# EAGLE design Reader_0001 (EAGLE 6.5.0)
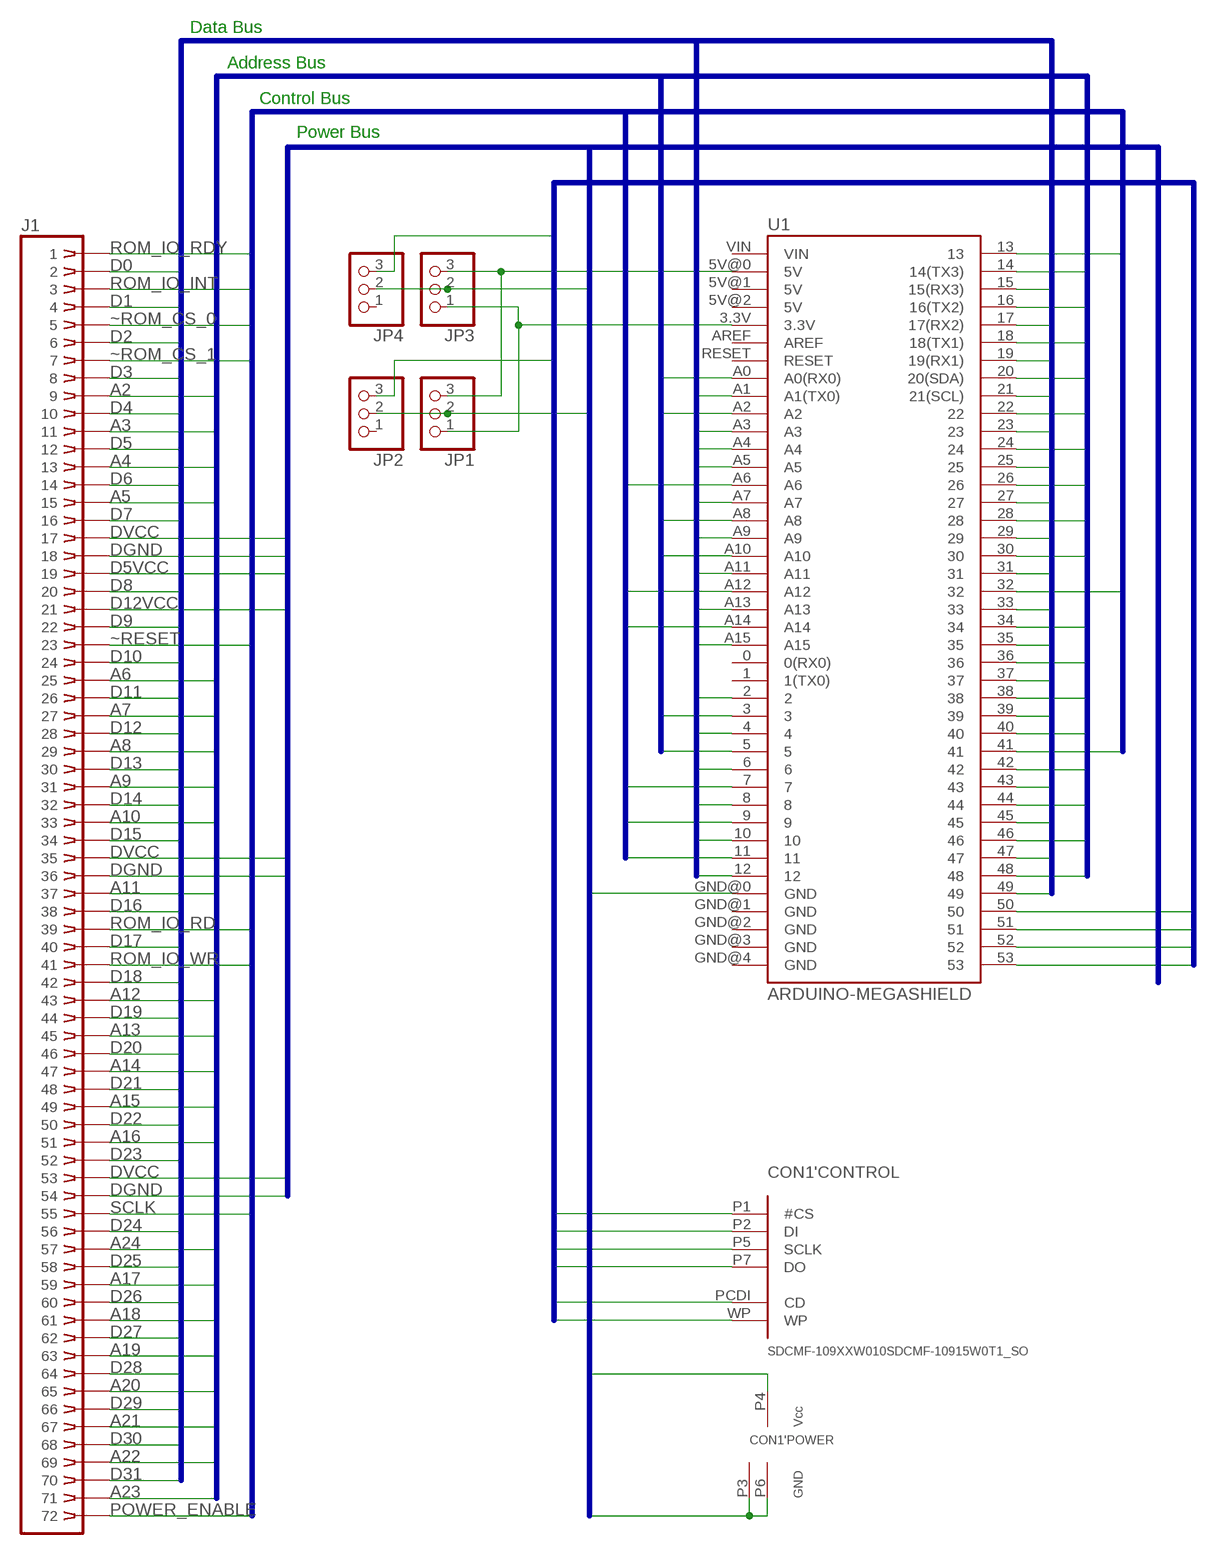
[diagram p0: schematic, sheet 1]

## Parts
CON1  SDCMF-109XXW010SDCMF-10915W0T1_SO  [SDCMF-10915W0T1]
J1  DIMM-M3  [177827-1]
JP1  PINHD-1X3  [1X03]
JP2  PINHD-1X3  [1X03]
JP3  PINHD-1X3  [1X03]
JP4  PINHD-1X3  [1X03]
U1  ARDUINO-MEGASHIELD  [ARDUINO_MEGA_SHIELD]

## Nets
A2: J1.9 U1.5
A3: J1.11 U1.3
A4: J1.13 U1.A0(A0(RX0))
A5: J1.15 U1.A2
A6: J1.25 U1.14(14(TX3))
A7: J1.27 U1.16(16(TX2))
A8: J1.29 U1.18(18(TX1))
A9: J1.31 U1.20(20(SDA))
A10: J1.33 U1.A8
A11: J1.37 U1.A10
A12: J1.43 U1.22
A13: J1.45 U1.24
A14: J1.47 U1.26
A15: J1.49 U1.28
A16: J1.51 U1.30
A17: J1.59 U1.36
A18: J1.61 U1.38
A19: J1.63 U1.40
A20: J1.65 U1.48
A21: J1.67 U1.46
A22: J1.69 U1.44
A23: J1.71 U1.42
A24: J1.57 U1.34
D0: J1.2 U1.12
D1: J1.4 U1.10
D2: J1.6 U1.8
D3: J1.8 U1.6
D4: J1.10 U1.4
D5: J1.12 U1.2
D5VCC: J1.19 JP1.2 JP2.2
D6: J1.14 U1.A1(A1(TX0))
D7: J1.16 U1.A3
D8: J1.20 U1.A4
D9: J1.22 U1.A5
D10: J1.24 U1.A7
D11: J1.26 U1.15(15(RX3))
D12: J1.28 U1.17(17(RX2))
D12VCC: J1.21
D13: J1.30 U1.19(19(RX1))
D14: J1.32 U1.21(21(SCL))
D15: J1.34 U1.A9
D16: J1.38 U1.A11
D17: J1.40 U1.A13
D18: J1.42 U1.A15
D19: J1.44 U1.23
D20: J1.46 U1.25
D21: J1.48 U1.27
D22: J1.50 U1.29
D23: J1.52 U1.31
D24: J1.56 U1.33
D25: J1.58 U1.35
D26: J1.60 U1.37
D27: J1.62 U1.39
D28: J1.64 U1.49
D29: J1.66 U1.47
D30: J1.68 U1.45
D31: J1.70 U1.43
DGND: CON1.P3('POWER:GND) CON1.P6('POWER:GND) J1.18 J1.36 J1.54 U1.GND@0(GND)
DVCC: CON1.P4('POWER:VCC) J1.17 J1.35 J1.53 JP3.2 JP4.2
N$1: JP1.3 JP3.3 U1.5V@0(5V)
N$2: JP1.1 JP3.1 U1.3.3V
POWER_ENABLE: J1.72 U1.41
ROM_IO_INT: J1.3 U1.11
ROM_IO_RD: J1.39 U1.A12
ROM_IO_RDY: J1.1 U1.13
ROM_IO_WR: J1.41 U1.A14
SCLK: J1.55 U1.32
SD_CD: CON1.PCDI('CONTROL:CD)
SD_CLCK: CON1.P5('CONTROL:SCLK) U1.52
SD_CS: CON1.P1('CONTROL:#CS) U1.53
SD_DI: CON1.P2('CONTROL:DI) JP2.3 U1.51
SD_DO: CON1.P7('CONTROL:DO) JP4.3 U1.50
SD_WP: CON1.WP('CONTROL:WP)
~RESET: J1.23 U1.A6
~ROM_CS_0: J1.5 U1.9
~ROM_CS_1: J1.7 U1.7
Unconnected: JP2.1 JP4.1 U1.0(0(RX0)) U1.1(1(TX0)) U1.5V@1(5V) U1.5V@2(5V) U1.AREF U1.GND@1(GND) U1.GND@2(GND) U1.GND@3(GND) U1.GND@4(GND) U1.RESET U1.VIN

## Buses
D[0..31]
A[0..31]
ROM_IO_RDY,ROM_IO_INT,~ROM_CS_0,~ROM_CS_1,~RESET,ROM_IO_RD,ROM_IO_WR,POWER_ENABLE,SCLK
DVCC,DGND,D12VCC,D5VCC
SD_CS,SD_DI,SD_DO,SD_CLCK,SD_CD,SD_WP

## Notes on the sheet
- Data Bus
- Address Bus
- Control Bus
- Power Bus

## Library data of the parts
CON1 = card_adapters:SDCMF-109XXW010: KingFont SD-CARD SDCMF-109XXW010 SPI -MODE
J1 = con-amp:DIMM-M3: AMP connector
JP1-JP4 = pinhead:PINHD-1X3: PIN HEADER
U1 = SparkFun-Boards:ARDUINO-MEGA: Arduino Mega board footprint

## Board
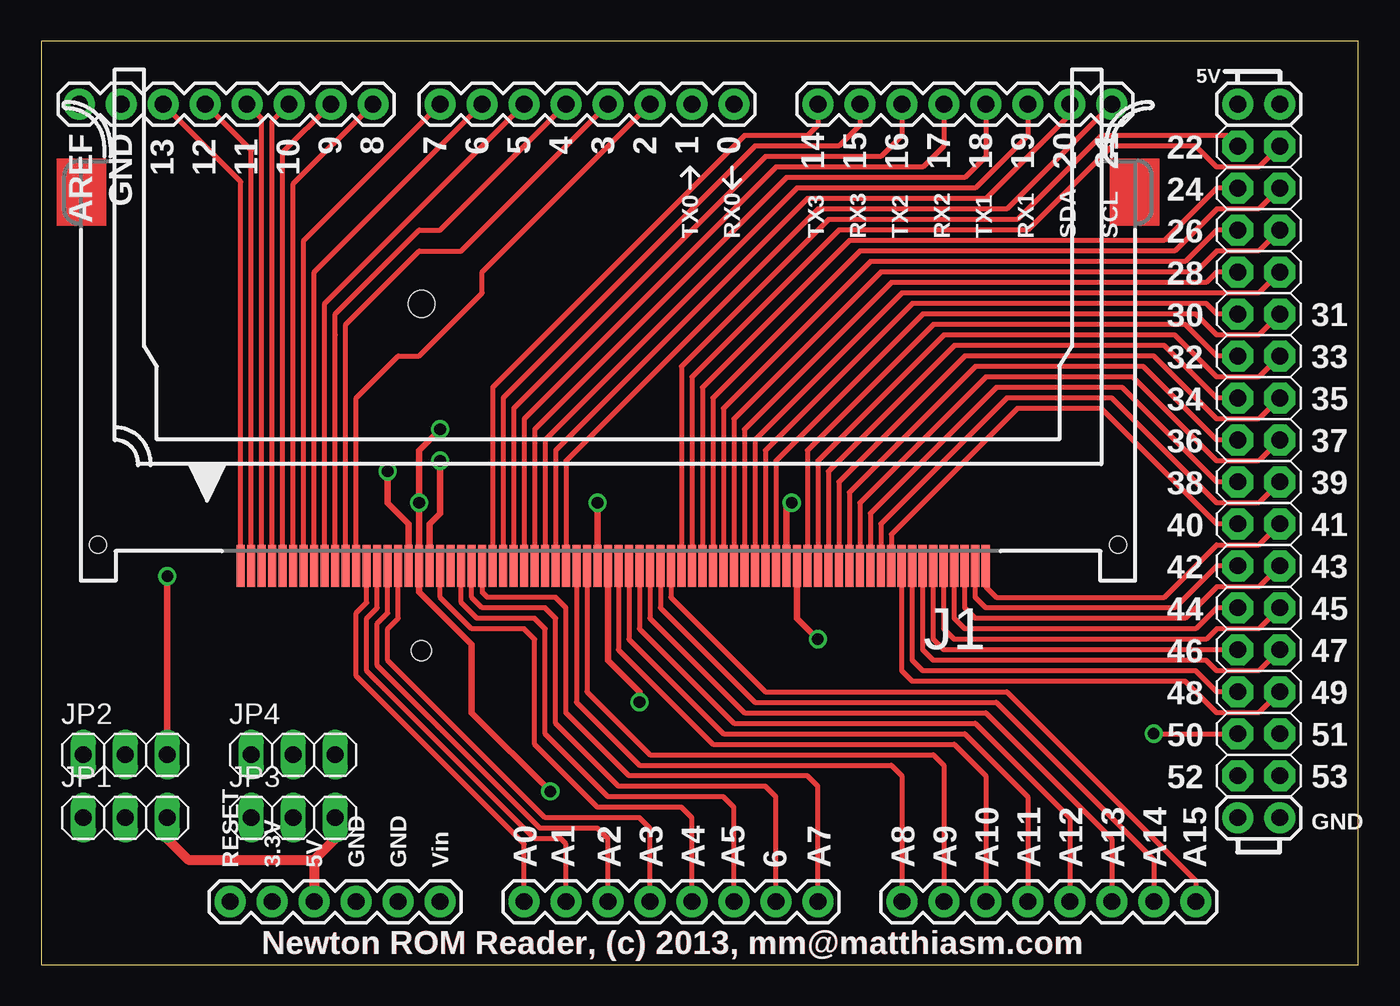
[diagram p1: board, top side]
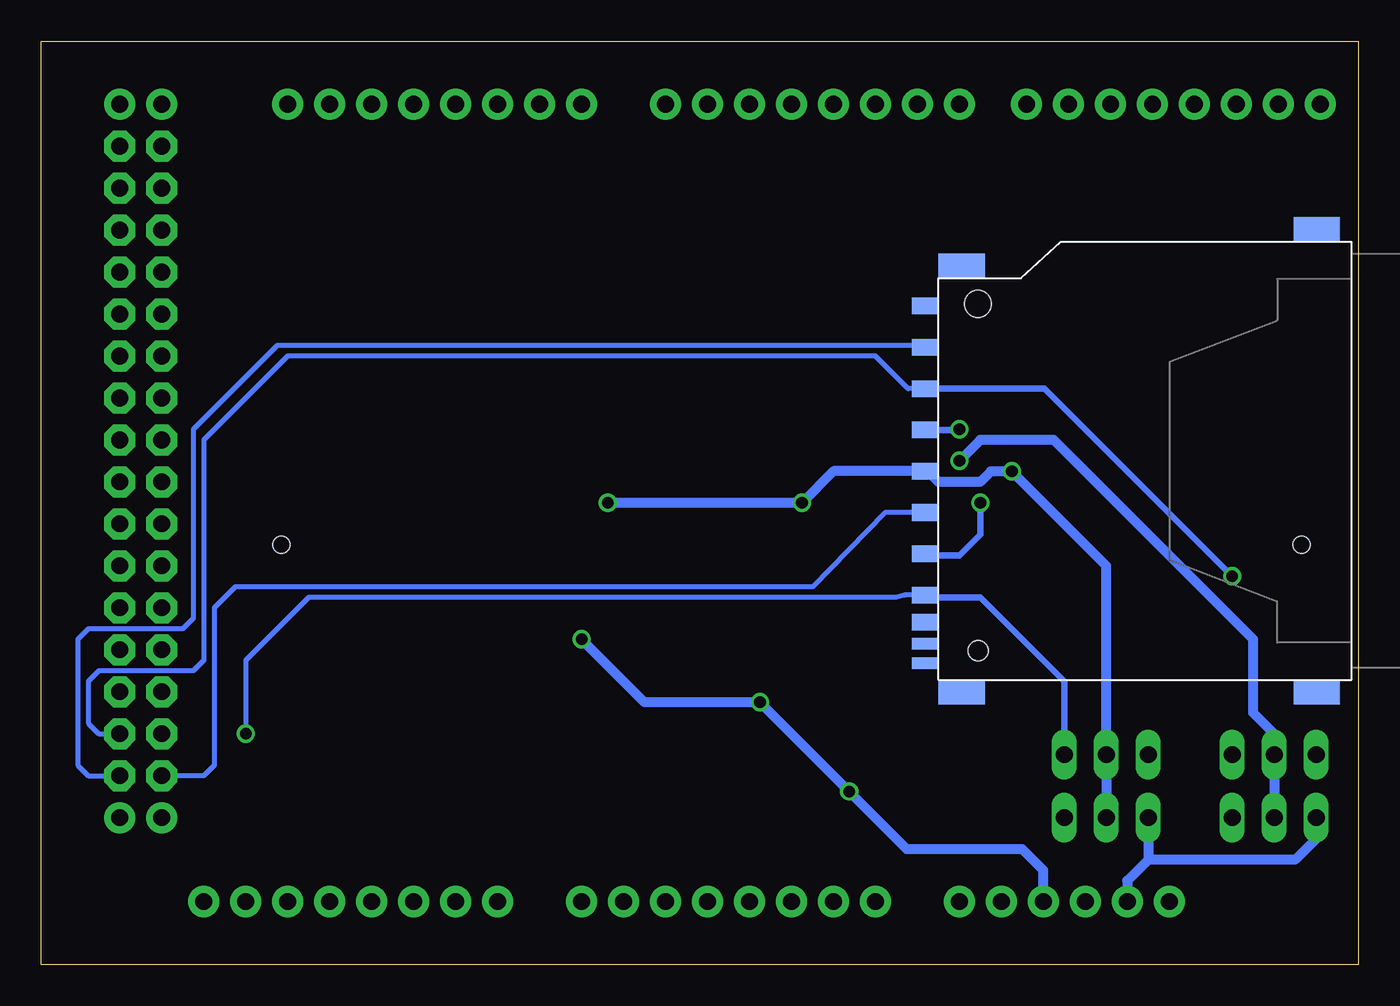
[diagram p2: board, bottom side, seen from below]

Size 79.68 x 55.87 mm. Coordinates in mm from the lower left corner, seen from the top.
Outline: 0,0 79.68,0 79.68,55.87 0,55.87 0,0
Copper layers (1*16): Top 0.035mm / dielectric 1.5mm / Bottom 0.035mm
Design rules "default": minimum track width 10mil, minimum drill 24mil, track to track 8mil, track to pad 8mil, pad to pad 8mil, via to via 8mil, smd to smd 8mil, copper to edge 40mil, drill to drill 8mil, minimum pad ring 10mil, minimum via ring 8mil, stop-mask expansion 4mil, vias tented up to drill 0mil, thermal gap 10mil

### Footprints (pad centres in the part's own frame; a part is rotated, then mirrored left to right if it is on the bottom)
SDCMF-10915W0T1 = smd 1.5 x 2.8: F1 -14,-1.4; F2 11.8,-1.4; F3 -14,-22.9; F4 14,-22.9 | smd 1 x 1.5: P1 6.875,0.85; P2 4.375,0.85; P3 1.875,0.85; P4 -0.625,0.85; P5 -3.125,0.85; P6 -5.625,0.85; P7 -8.125,0.85; P8 -9.75,0.85; P9 9.375,0.85 | smd 0.7 x 1.5: PCDI -11.05,0.85; WP -12.25,0.85 | hole 1.6: 9.5,-2.4 | hole 1.2: -11.5,-2.4
177827-1 = smd 0.508 x 2.54: 1 22.225,1.27; 2 21.59,1.27; 3 20.955,1.27; 4 20.32,1.27; 5 19.685,1.27; 6 19.05,1.27; 7 18.415,1.27; 8 17.78,1.27; 9 17.145,1.27; 10 16.51,1.27; 11 15.875,1.27; 12 15.24,1.27; 13 14.605,1.27; 14 13.97,1.27; 15 13.335,1.27; 16 12.7,1.27; 17 12.065,1.27; 18 11.43,1.27; 19 10.795,1.27; 20 10.16,1.27; 21 9.525,1.27; 22 8.89,1.27; 23 8.255,1.27; 24 7.62,1.27; 25 6.985,1.27; 26 6.35,1.27; 27 5.715,1.27; 28 5.08,1.27; 29 4.445,1.27; 30 3.81,1.27; 31 3.175,1.27; 32 2.54,1.27; 33 1.905,1.27; 34 1.27,1.27; 35 0.635,1.27; 36 0,1.27; 37 -0.635,1.27; 38 -1.27,1.27; 39 -1.905,1.27; 40 -2.54,1.27; 41 -3.175,1.27; 42 -3.81,1.27; 43 -4.445,1.27; 44 -5.08,1.27; 45 -5.715,1.27; 46 -6.35,1.27; 47 -6.985,1.27; 48 -7.62,1.27; 49 -8.255,1.27; 50 -8.89,1.27; 51 -9.525,1.27; 52 -10.16,1.27; 53 -10.795,1.27; 54 -11.43,1.27; 55 -12.065,1.27; 56 -12.7,1.27; 57 -13.335,1.27; 58 -13.97,1.27; 59 -14.605,1.27; 60 -15.24,1.27; 61 -15.875,1.27; 62 -16.51,1.27; 63 -17.145,1.27; 64 -17.78,1.27; 65 -18.415,1.27; 66 -19.05,1.27; 67 -19.685,1.27; 68 -20.32,1.27; 69 -20.955,1.27; 70 -21.59,1.27; 71 -22.225,1.27; 72 -22.86,1.27 | hole 1.016: -30.861,0; 30.861,0
1X03 = drill 1.016 long: 1 -2.54,0; 2 0,0; 3 2.54,0
ARDUINO_MEGA_SHIELD = drill 1.016 pad 1.88: 0 12.7,24.13; 1 10.16,24.13; 2 7.62,24.13; 3 5.08,24.13; 3.3V -15.24,-24.13; 4 2.54,24.13; 5 0,24.13; 5V@0 -12.7,-24.13; 5V@1 43.18,24.13; 5V@2 45.72,24.13; 6 -2.54,24.13; 7 -5.08,24.13; 8 -9.144,24.13; 9 -11.684,24.13; 10 -14.224,24.13; 11 -16.764,24.13; 12 -19.304,24.13; 13 -21.844,24.13; 14 17.78,24.13; 15 20.32,24.13; 16 22.86,24.13; 17 25.4,24.13; 18 27.94,24.13; 19 30.48,24.13; 20 33.02,24.13; 21 35.56,24.13; A0 0,-24.13; A1 2.54,-24.13; A2 5.08,-24.13; A3 7.62,-24.13; A4 10.16,-24.13; A5 12.7,-24.13; A6 15.24,-24.13; A7 17.78,-24.13; A8 22.86,-24.13; A9 25.4,-24.13; A10 27.94,-24.13; A11 30.48,-24.13; A12 33.02,-24.13; A13 35.56,-24.13; A14 38.1,-24.13; A15 40.64,-24.13; AREF -26.924,24.13; GND@0 -10.16,-24.13; GND@1 -7.62,-24.13; GND@2 43.18,-19.05; GND@3 45.72,-19.05; GND@4 -24.384,24.13; RESET -17.78,-24.13; VIN -5.08,-24.13 | drill 1.016 pad 1.88 octagon: 22 43.18,21.59; 23 45.72,21.59; 24 43.18,19.05; 25 45.72,19.05; 26 43.18,16.51; 27 45.72,16.51; 28 43.18,13.97; 29 45.72,13.97; 30 43.18,11.43; 31 45.72,11.43; 32 43.18,8.89; 33 45.72,8.89; 34 43.18,6.35; 35 45.72,6.35; 36 43.18,3.81; 37 45.72,3.81; 38 43.18,1.27; 39 45.72,1.27; 40 43.18,-1.27; 41 45.72,-1.27; 42 43.18,-3.81; 43 45.72,-3.81; 44 43.18,-6.35; 45 45.72,-6.35; 46 43.18,-8.89; 47 45.72,-8.89; 48 43.18,-11.43; 49 45.72,-11.43; 50 43.18,-13.97; 51 45.72,-13.97; 52 43.18,-16.51; 53 45.72,-16.51

### Placement (x,y rotation side)
CON1  25.4,30.48 90 bottom
J1  34.29,25.4 180 top
JP1  5.08,8.89 0 top
JP2  5.08,12.7 0 top
JP3  15.24,8.89 0 top
JP4  15.24,12.7 0 top
U1  29.21,27.94 0 top

### Tracks (layer width: path | path; a pad name or v marks a point on that pad's centre or on a via)
A2
  Top 0.305: J1.9 17.14,40.01 U1.5
A3
  Top 0.305: J1.11 18.41,38.73 22.86,43.18 25.4,43.18 U1.3
A4
  Top 0.305: U1.A0 29.21,7.3 19.05,17.46 19.05,21.27 19.68,21.91 J1.13
A5
  Top 0.305: U1.A2 34.29,7.62 33.66,8.26 30.16,8.26 20.32,18.1 20.32,20.64 20.95,21.27 J1.15
A6
  Top 0.305: U1.14 46.99,50.8 46.35,50.16 42.55,50.16 27.3,34.92 J1.25
A7
  Top 0.305: U1.16 52.07,50.16 50.8,48.9 43.81,48.9 28.57,33.66 J1.27
A8
  Top 0.305: U1.18 57.15,48.9 55.88,47.62 45.09,47.62 29.84,32.38 J1.29
A9
  Top 0.305: U1.20 62.23,51.44 57.15,46.35 46.35,46.35 31.11,31.11 J1.31
A10
  Top 0.305: J1.33 32.38,15.88 36.2,12.06 51.44,12.06 52.07,11.43 U1.A8
A11
  Top 0.305: J1.37 34.92,19.05 40.64,13.34 55.24,13.34 57.15,11.43 U1.A10
A12
  Top 0.305: U1.22 71.75,50.16 64.14,50.16 59.05,45.09 47.62,45.09 38.73,36.2 J1.43
A13
  Top 0.305: U1.24 71.12,46.99 67.94,43.81 48.9,43.81 40.01,34.92 J1.45
A14
  Top 0.305: U1.26 71.12,44.45 69.22,42.55 50.16,42.55 41.27,33.66 J1.47
A15
  Top 0.305: U1.28 71.12,41.91 70.48,41.27 51.44,41.27 42.55,32.38 J1.49
A16
  Top 0.305: U1.30 71.12,39.37 70.48,40.01 52.7,40.01 43.81,31.11 J1.51
A17
  Top 0.305: U1.36 71.12,31.75 66.67,36.2 56.52,36.2 48.9,28.57 J1.59
A18
  Top 0.305: U1.38 71.12,29.21 65.41,34.92 57.78,34.92 50.16,27.3 J1.61
A19
  Top 0.305: U1.40 71.12,26.67 64.14,33.66 59.05,33.66 51.44,26.04 J1.63
A20
  Top 0.305: U1.48 71.12,16.51 69.85,17.78 53.34,17.78 52.7,18.41 J1.65
A21
  Top 0.305: U1.46 54.61,19.05 53.98,19.68 J1.67
A22
  Top 0.305: U1.44 71.12,21.59 69.85,20.32 55.88,20.32 55.24,20.95 J1.69
A23
  Top 0.305: U1.42 71.12,24.13 68.58,21.59 57.15,21.59 56.52,22.23 J1.71
A24
  Top 0.305: U1.34 71.12,34.29 67.94,37.47 55.24,37.47 47.62,29.84 J1.57
D0
  Top 0.305: J1.2 12.7,49.28 U1.12
D1
  Top 0.305: J1.4 13.97,51.05 U1.10
D2
  Top 0.305: J1.6 15.24,47.24 U1.8
D3
  Top 0.305: J1.8 16.51,41.91 U1.6
D4
  Top 0.305: J1.10 17.78,38.1 17.78,39.37 20.32,41.91 22.86,44.45 24.13,44.45 U1.4
D5
  Top 0.305: J1.12 19.05,34.29 21.59,36.83 22.86,36.83 26.67,40.64 26.67,41.91 U1.2
D5VCC  (via drill 0.7)
  Top 0.406: J1.19 23.5,26.67 24.13,27.3 v24.13,30.48
  Bottom 0.61: JP1.2 JP2.2 5.08,13.97 6.35,15.24 6.35,19.68 18.41,31.75 22.86,31.75 v24.13,30.48
D6
  Top 0.305: U1.A1 31.75,7.3 31.43,7.62 29.84,7.62 19.68,17.78 19.68,20.95 20.32,21.59 J1.14
D7
  Top 0.305: U1.A3 36.83,8.26 36.2,8.89 30.48,8.89 20.95,18.41 20.95,20.32 21.59,20.95 J1.16
D8
  Top 0.305: U1.A4 39.37,8.89 38.73,9.53 33.66,9.53 29.84,13.34 29.84,19.68 29.21,20.32 26.04,20.32 24.13,22.23 J1.20
D9
  Top 0.305: U1.A5 41.91,9.53 41.27,10.16 34.29,10.16 30.48,13.97 30.48,20.32 29.84,20.95 26.35,20.95 25.4,21.91 J1.22
D10
  Top 0.305: J1.24 26.67,22.54 26.99,22.23 31.11,22.23 31.75,21.59 31.75,15.24 35.56,11.43 46.35,11.43 46.99,10.79 U1.A7
D11
  Top 0.305: U1.15 49.53,50.8 48.26,49.53 43.18,49.53 27.94,34.29 J1.26
D12
  Top 0.305: U1.17 54.61,49.53 53.34,48.26 44.45,48.26 29.21,33.02 J1.28
D13
  Top 0.305: U1.19 59.69,50.16 56.52,46.99 45.72,46.99 30.48,31.75 J1.30
D14
  Top 0.305: U1.21 58.42,45.72 46.99,45.72 31.75,30.48 J1.32
D15
  Top 0.305: J1.34 33.02,16.51 36.83,12.7 53.98,12.7 54.61,12.06 U1.A9
D16
  Top 0.305: J1.38 35.56,19.68 41.27,13.97 55.88,13.97 59.69,10.16 U1.A11
D17
  Top 0.305: J1.40 36.83,20.95 42.55,15.24 57.15,15.24 64.77,7.62 U1.A13
D18
  Top 0.305: J1.42 38.1,22.23 43.81,16.51 58.42,16.51 69.85,5.08 U1.A15
D19
  Top 0.305: U1.23 73.66,48.26 71.12,48.26 69.85,49.53 64.77,49.53 59.69,44.45 48.26,44.45 39.37,35.56 J1.44
D20
  Top 0.305: U1.25 73.66,45.72 71.12,45.72 68.58,43.18 49.53,43.18 40.64,34.29 J1.46
D21
  Top 0.305: U1.27 73.66,43.18 71.12,43.18 69.85,41.91 50.8,41.91 41.91,33.02 J1.48
D22
  Top 0.305: U1.29 73.66,40.64 52.07,40.64 43.18,31.75 J1.50
D23
  Top 0.305: U1.31 73.66,38.1 71.12,38.1 69.85,39.37 53.34,39.37 44.45,30.48 J1.52
D24
  Top 0.305: U1.33 73.66,35.56 71.12,35.56 68.58,38.1 54.61,38.1 46.99,30.48 J1.56
D25
  Top 0.305: U1.35 73.66,33.02 71.12,33.02 67.31,36.83 55.88,36.83 48.26,29.21 J1.58
D26
  Top 0.305: U1.37 73.66,30.48 71.12,30.48 66.04,35.56 57.15,35.56 49.53,27.94 J1.60
D27
  Top 0.305: U1.39 73.66,27.94 71.12,27.94 64.77,34.29 58.42,34.29 50.8,26.67 J1.62
D28
  Top 0.305: U1.49 73.66,15.24 71.12,15.24 69.22,17.14 52.7,17.14 52.07,17.78 J1.64
D29
  Top 0.305: U1.47 73.66,17.78 71.12,17.78 70.48,18.41 53.98,18.41 53.34,19.05 J1.66
D30
  Top 0.305: U1.45 73.66,20.32 71.12,20.32 70.48,19.68 55.24,19.68 54.61,20.32 J1.68
D31
  Top 0.305: U1.43 73.66,22.86 71.12,22.86 69.22,20.95 56.52,20.95 55.88,21.59 J1.70
DGND  (via drill 0.7)
  Top 0.406: J1.54 45.72,20.95 v46.99,19.68 | J1.36 34.29,18.41 36.2,16.51 v36.2,15.88 | v30.8,10.48 26.04,15.24 26.04,19.37 22.86,22.54 J1.18 v22.86,27.94 22.86,31.11 v24.13,32.38
  Bottom 0.406: v22.86,27.94 22.86,26.04 24.13,24.77 26.16,24.77 CON1.P6 | CON1.P3 24.16,32.35 v24.13,32.38
  Bottom 0.61: U1.GND@0 19.05,5.71 20.32,6.99 27.3,6.99 v30.8,10.48 v36.2,15.88 43.18,15.88 v46.99,19.68
DVCC  (via drill 0.7)
  Top 0.406: v20.95,29.84 20.95,27.94 22.23,26.67 J1.17 | J1.35 v33.66,27.94 | J1.53 45.09,27.62 v45.4,27.94
  Bottom 0.61: JP3.2 JP4.2 15.24,24.13 v20.95,29.84 22.23,29.84 22.86,29.21 25.4,29.21 26.04,29.84 26.24,29.84 CON1.P4 31.74,29.86 v33.66,27.94 v45.4,27.94
N$1
  Top 0.61: JP1.3 7.62,7.62 8.89,6.35 16.51,6.35 | 16.51,6.35 U1.5V@0 | JP3.3 17.78,7.62 16.51,6.35
N$2
  Bottom 0.61: JP1.1 2.54,7.62 3.81,6.35 12.7,6.35 | JP3.1 12.7,6.35 | 12.7,6.35 13.97,5.08 U1.3.3V
POWER_ENABLE
  Top 0.305: J1.72 57.15,22.86 57.78,22.23 67.94,22.23 71.12,25.4 73.66,25.4 U1.41
ROM_IO_INT
  Top 0.305: J1.3 13.34,51.18 U1.11
ROM_IO_RD
  Top 0.305: J1.39 36.2,20.32 41.91,14.61 56.52,14.61 62.23,8.89 U1.A12
ROM_IO_RDY
  Top 0.305: J1.1 12.06,47.37 U1.13
ROM_IO_WR
  Top 0.305: J1.41 37.47,21.59 43.18,15.88 57.78,15.88 67.31,6.35 U1.A14
SCLK
  Top 0.305: U1.32 71.12,36.83 69.22,38.73 53.98,38.73 46.35,31.11 J1.55
SD_CLCK
  Bottom 0.305: CON1.P5 28.62,27.36 33.02,22.86 67.94,22.86 69.22,21.59 69.22,12.06 69.85,11.43 U1.52
SD_CS
  Bottom 0.305: CON1.P1 26.14,37.35 26.04,37.47 65.41,37.47 70.48,32.38 70.48,20.95 71.12,20.32 76.83,20.32 77.47,19.68 77.47,12.06 76.83,11.43 U1.53
SD_DI  (via drill 0.7)
  Top 0.406: v7.62,23.5 JP2.3
  Bottom 0.305: CON1.P2 27.23,34.85 29.21,36.83 64.77,36.83 69.85,31.75 69.85,18.41 70.48,17.78 76.2,17.78 76.83,17.14 76.83,14.61 76.2,13.97 U1.51
  Bottom 0.406: CON1.P2 18.98,34.85 v7.62,23.5
SD_DO  (via drill 0.7)
  Top 0.305: v67.31,13.97 U1.50
  Bottom 0.305: CON1.P7 27.43,22.36 27.94,22.23 63.5,22.23 67.31,18.41 v67.31,13.97
  Bottom 0.406: JP4.3 17.78,17.14 22.86,22.23 26.12,22.23 CON1.P7
~RESET
  Top 0.305: U1.A6 44.45,10.16 43.81,10.79 34.92,10.79 31.11,14.61 31.11,20.95 30.48,21.59 26.67,21.59 26.04,22.23 J1.23
~ROM_CS_0
  Top 0.305: J1.5 14.61,49.15 U1.9
~ROM_CS_1
  Top 0.305: J1.7 15.88,43.81 U1.7

### Text on the board
Top: Newton ROM Reader, (c) 2013, mm@matthiasm.com
tNames: Newton ROM Reader, (c) 2013, mm@matthiasm.com